# Altium project niryoStepperController.PrjPcb
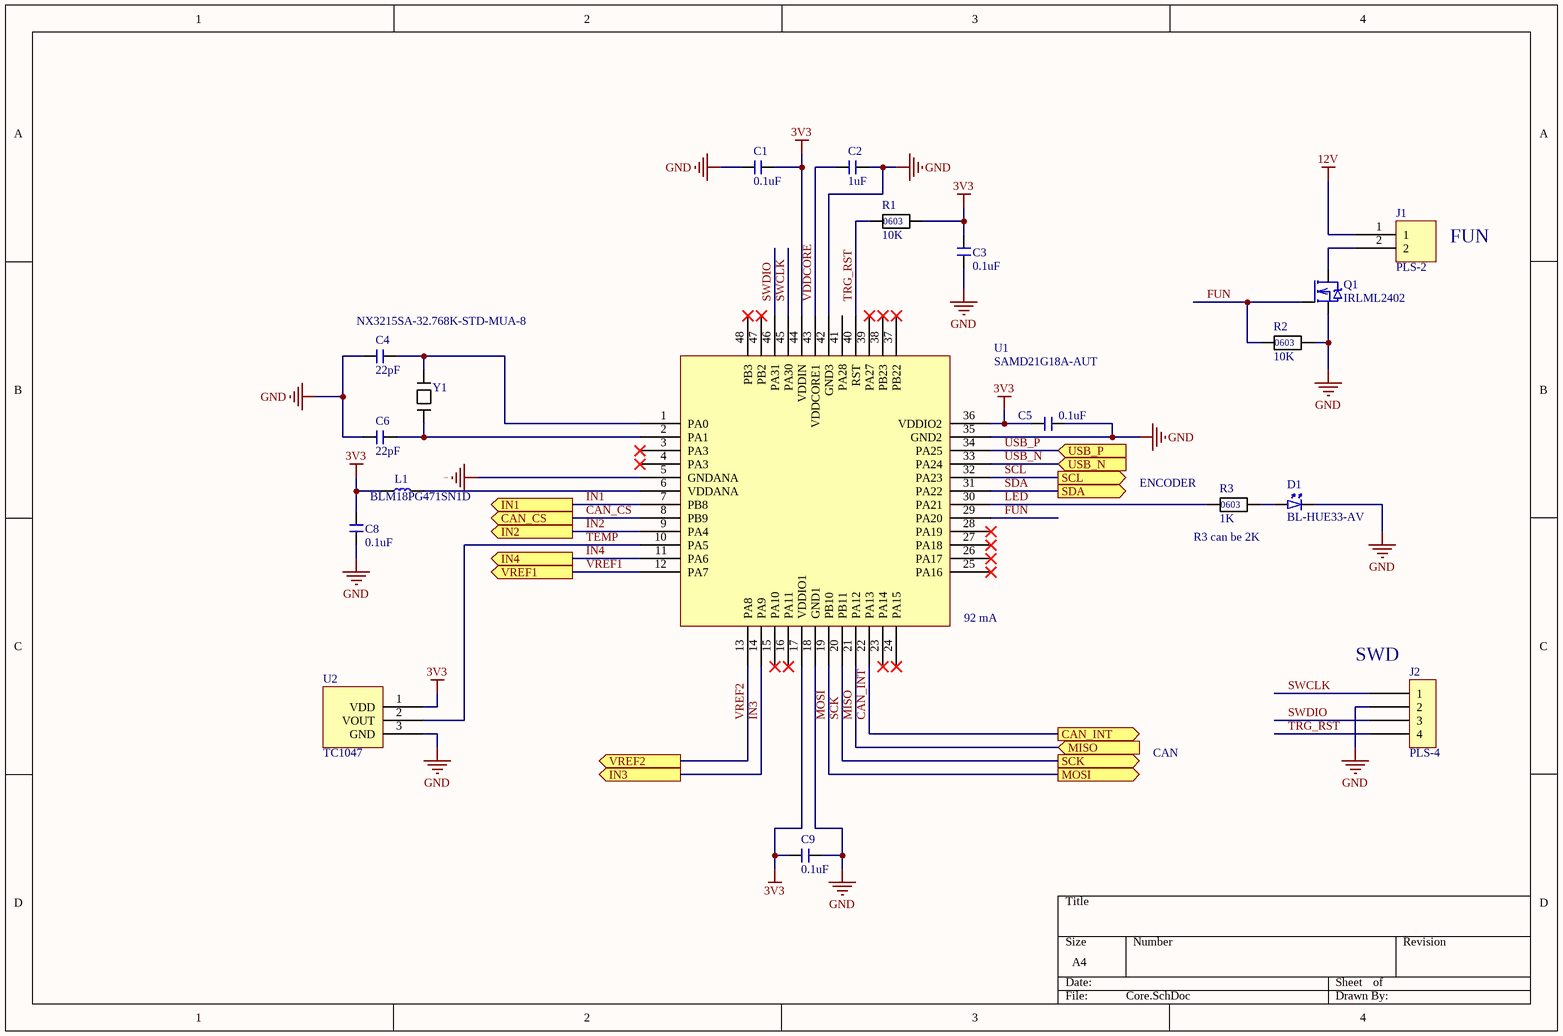
[diagram p0: Core.SchDoc]
3 sheets, 72 parts. Net scope: flat (ports and power ports of the same name join across sheets).
Board file: stepperPCB.PcbDoc
Sheets:
  Core.SchDoc
  Stepper.SchDoc
  CAN.SchDoc

## Sheet Core.SchDoc
size A4

### Parts
C1  0.1uF  [CHIP_C_0603]
C2  1uF  [CHIP_C_0603]
C3  0.1uF  [CHIP_C_0603]
C4  22pF  [CHIP_C_0603]
C5  0.1uF  [CHIP_C_0603]
C6  22pF  [CHIP_C_0603]
C8  0.1uF  [CHIP_C_0603]
C9  0.1uF  [CHIP_C_0603]
D1  BL-HUE33-AV  [CHIP_D_0603]
J1  PLS-2  [PLS-2]
J2  PLS-4  [PLS-4]
L1  BLM18PG471SN1D  [CHIP_R_0603]
Q1  IRLML2402  [SOT23]
R1  10K  [CHIP_R_0603]
R2  10K  [CHIP_R_0603]
R3  1K  [CHIP_R_0603]
U1  SAMD21G18A-AUT  [LQFP48]
U2  TC1047  [SOT23]
Y1  NX3215SA-32.768K-STD-MUA-8  [NX3215SA]

### Ports
CAN_CS (out), CAN_INT (out), IN1 (out), IN2 (out), IN3 (out), IN4 (out), MISO (in), MOSI (out), SCK (out), SCL (out), SDA (out), USB_N (in), USB_P (in), VREF1 (out), VREF2 (out)

### Nets
3V3: C1.2 C3.2 C5.1 C8.2 C9.1 L1.1 R1.2 U1.17(VDDIO1) U1.36(VDDIO2) U1.44(VDDIN) U2.1(VDD)
12V: J1.1
GND: C1.1 C2.2 C3.1 C4.1 C5.2 C6.1 C8.1 C9.2 D1.2(C) J2.2 Q1.2(S) R2.2 U1.5(GNDANA) U1.18(GND1) U1.35(GND2) U1.42(GND3) U2.3(GND)
CAN_CS: U1.8(PB9) ; port CAN_CS
CAN_INT: U1.22(PA13) ; port CAN_INT
FUN: Q1.1(G) R2.1 U1.29(PA20)
IN1: U1.7(PB8) ; port IN1
IN2: U1.9(PA4) ; port IN2
IN3: U1.14(PA9) ; port IN3
IN4: U1.11(PA6) ; port IN4
LED: R3.1 U1.30(PA21)
MISO: U1.21(PA12) ; port MISO
MOSI: U1.19(PB10) ; port MOSI
SCK: U1.20(PB11) ; port SCK
SCL: U1.32(PA23) ; port SCL
SDA: U1.31(PA22) ; port SDA
SWCLK: J2.1 U1.45(PA30)
SWDIO: J2.3 U1.46(PA31)
TEMP: U1.10(PA5) U2.2(VOUT)
TRG_RST: J2.4 R1.1 U1.40(RST)
USB_N: U1.33(PA24) ; port USB_N
USB_P: U1.34(PA25) ; port USB_P
VDDCORE: C2.1 U1.43(VDDCORE1)
VREF1: U1.12(PA7) ; port VREF1
VREF2: U1.13(PA8) ; port VREF2
NetC4_2: C4.2 U1.1(PA0) Y1.2
NetC6_2: C6.2 U1.2(PA1) Y1.1
NetD1_1: D1.1(A) R3.2
NetJ1_2: J1.2 Q1.3(D)
NetL1_2: L1.2 U1.6(VDDANA)

Not connected (* = marked no-connect by the designer): U1 3(PA3)* 4(PA3)* 15(PA10)* 16(PA11)* 23(PA14)* 24(PA15)* 25(PA16)* 26(PA17)* 27(PA18)* 28(PA19)* 37(PB22)* 38(PB23)* 39(PA27)* 41(PA28) 47(PB2)* 48(PB3)*

### Notes on the sheet
- FUN
- (near R3) ENCODER
- R3 can be 2K
- (near U1) 92 mA
- (near J2) SWD
- CAN
- (in symbol RES_0603) 0603

### Library data of the parts
C1-C6 C8 C9 = CHIP_C
D1 = KP-3216: LED
J1 = PLS-2: Connector
L1 = BLM
Q1 = IRLML2402: n-chanal MOSFET
R1-R3 = RES_0603
U2 = TC1047: Temperature Sensor
Y1 = Quartz

## Sheet Stepper.SchDoc
size A4
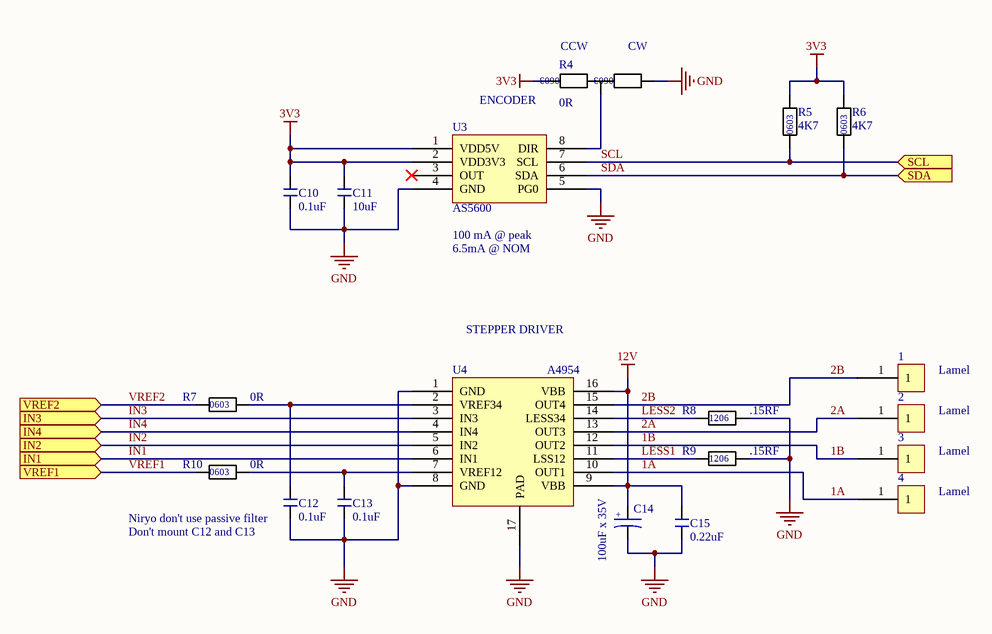
[diagram p1: Stepper.SchDoc]

### Parts
1  Lamel  [LAMEL]
2  Lamel  [LAMEL]
3  Lamel  [LAMEL]
4  Lamel  [LAMEL]
C10  0.1uF  [CHIP_C_0603]
C11  10uF  [CHIP_C_0603]
C12  0.1uF  [CHIP_C_0603]
C13  0.1uF  [CHIP_C_0603]
C14  100uF x 35V  [ALUM_CAP_D]
C15  0.22uF  [CHIP_C_0603]
R4  0R  [0R 0603 selector]
R5  4K7  [CHIP_R_0603]
R6  4K7  [CHIP_R_0603]
R7  0R  [CHIP_R_0603]
R8  .15RF  [CHIP_R_1206]
R9  .15RF  [CHIP_R_1206]
R10  0R  [CHIP_R_0603]
U3  AS5600  [SOIC8]
U4  A4954  [TSSOP-16P]

### Ports
IN1 (in), IN2 (in), IN3 (in), IN4 (in), SCL (in), SDA (in), VREF1 (in), VREF2 (in)

### Nets
3V3: C10.2 C11.2 R4.1 R5.2 R6.2 U3.1(VDD5V) U3.2(VDD3V3)
12V: C14.2 C15.2 U4.9(VBB) U4.16(VBB)
GND: C10.1 C11.1 C12.1 C13.1 C14.1 C15.1 R4.3 R8.2 R9.2 U3.4(GND) U3.5(PG0) U4.1(GND) U4.8(GND) U4.17(PAD)
1A: 4.1 U4.10(OUT1)
1B: 3.1 U4.12(OUT2)
2A: 2.1 U4.13(OUT3)
2B: 1.1 U4.15(OUT4)
IN1: U4.6(IN1) ; port IN1
IN2: U4.5(IN2) ; port IN2
IN3: U4.3(IN3) ; port IN3
IN4: U4.4(IN4) ; port IN4
LESS1: R9.1 U4.11(LSS12)
LESS2: R8.1 U4.14(LESS34)
SCL: R5.1 U3.7(SCL) ; port SCL
SDA: R6.1 U3.6(SDA) ; port SDA
VREF1: R10.1 ; port VREF1
VREF2: R7.1 ; port VREF2
NetC12_2: C12.2 R7.2 U4.2(VREF34)
NetC13_2: C13.2 R10.2 U4.7(VREF12)
NetR4_2: R4.2 U3.8(DIR)

Not connected (* = marked no-connect by the designer): U3 3(OUT)*

### Notes on the sheet
- (near R4) CCW
- (near R4) CW
- ENCODER
- (near U3) 100 mA @ peak
- 6.5mA @ NOM
- STEPPER DRIVER
- (near C12) Niryo don't use passive filter
- (near C12) Don't mount C12 and C13
- (in symbol Electrolit) +
- (in symbol RES_0603) 0603
- (in symbol RES_1206) 1206
- (in symbol Selector_0603) 0603

### Library data of the parts
C10-C13 C15 = CHIP_C
C14 = Electrolit
R4 = Selector_0603
R5-R7 R10 = RES_0603
R8 R9 = RES_1206: Resistor
U3 = AS5600: program magnetic rotary position  sensor
U4 = A4954: DMOS PWM Motor Driver

## Sheet CAN.SchDoc
size A4
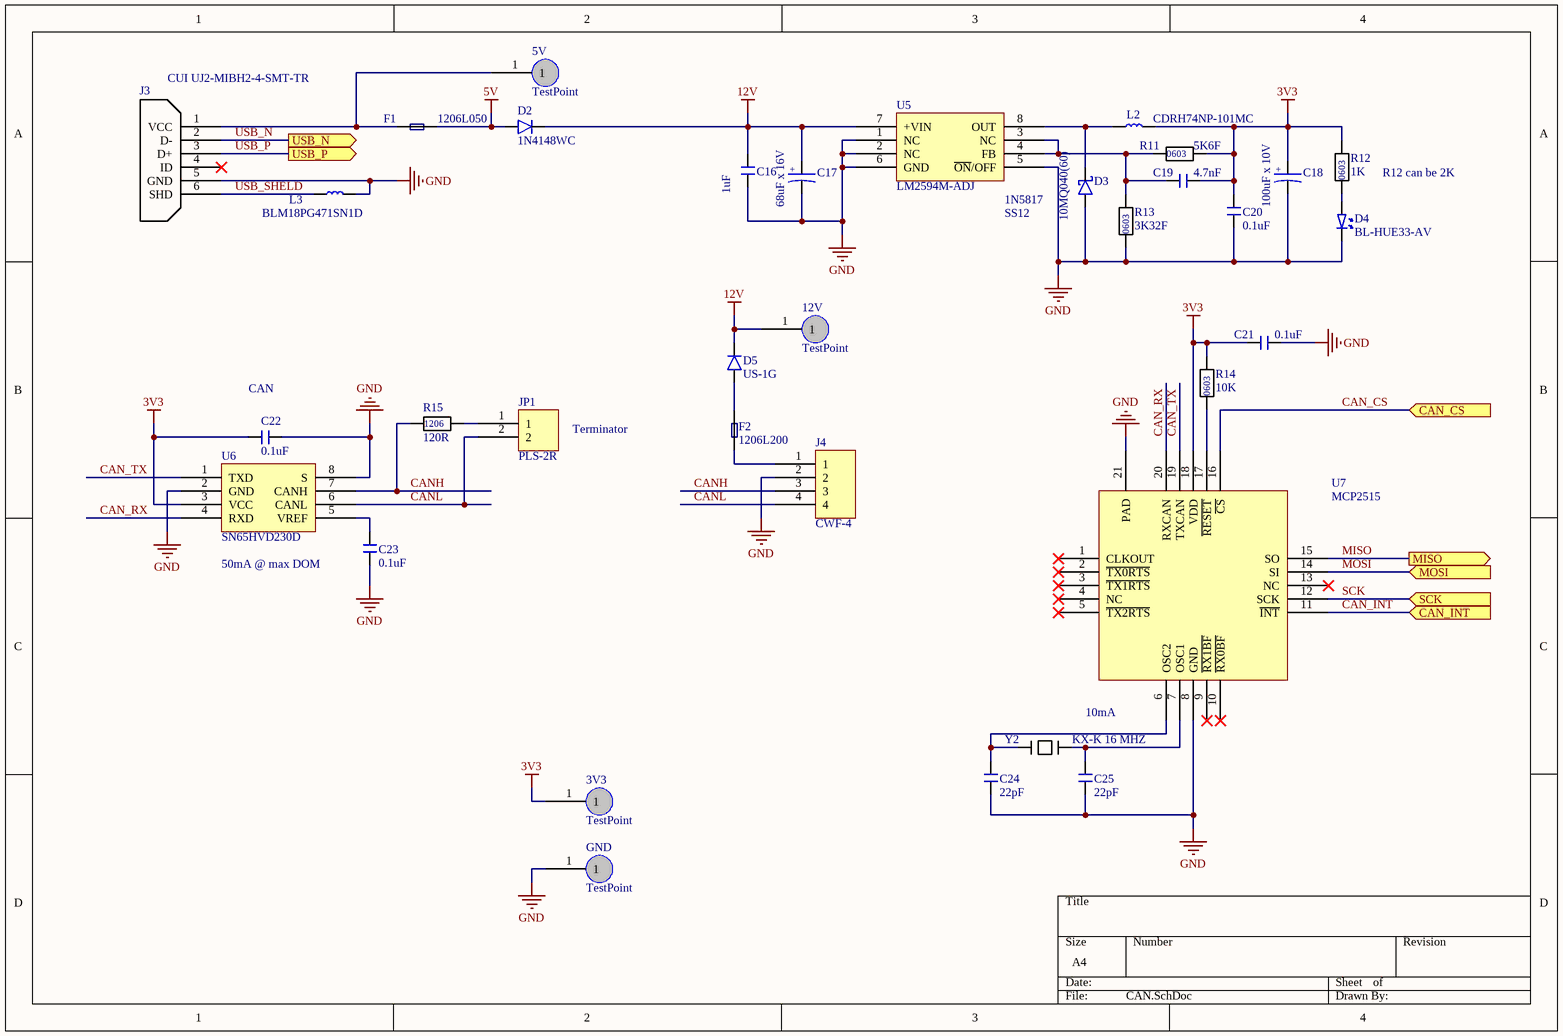
[diagram p2: CAN.SchDoc]

### Parts
3V3  TestPoint  [TestPoint]
5V  TestPoint  [TestPoint]
12V  TestPoint  [TestPoint]
C16  1uF  [CHIP_C_0805]
C17  68uF x 16V  [TANTAL - C]
C18  100uF x 10V  [Tantal - B]
C19  4.7nF  [CHIP_C_0603]
C20  0.1uF  [CHIP_C_0603]
C21  0.1uF  [CHIP_C_0603]
C22  0.1uF  [CHIP_C_0603]
C23  0.1uF  [CHIP_C_0603]
C24  22pF  [CHIP_C_0603]
C25  22pF  [CHIP_C_0603]
D2  1N4148WC  [SOD323]
D3  10MQ040(60)  [DO214-AC]
D4  BL-HUE33-AV  [CHIP_D_0603]
D5  US-1G  [DO214-AC]
F1  1206L050  [1206Lxxx]
F2  1206L200  [1206Lxxx]
GND  TestPoint  [TestPoint]
J3  CUI UJ2-MIBH2-4-SMT-TR  [MicroUSB-mc-258]
J4  CWF-4  [CWF-4R]
JP1  PLS-2R  [PLS-2R]
L2  CDRH74NP-101MC  [CDRH74]
L3  BLM18PG471SN1D  [CHIP_R_0603]
R11  5K6F  [CHIP_R_0603]
R12  1K  [CHIP_R_0603]
R13  3K32F  [CHIP_R_0603]
R14  10K  [CHIP_R_0603]
R15  120R  [CHIP_R_1206]
U5  LM2594M-ADJ  [SOIC8]
U6  SN65HVD230D  [SOIC8]
U7  MCP2515  [QFN20]
Y2  KX-K 16 MHZ  [CHIP_CRYSTAL_5032]

### Ports
CAN_CS (in), CAN_INT (in), MISO (out), MOSI (in), SCK (in), USB_N (out), USB_P (out)

### Nets
3V3: 3V3.1 C18.1 C19.1 C20.2 C21.2 C22.2 L2.2 R11.2 R12.2 R14.2 U6.3(VCC) U7.18(VDD)
5V: D2.2 F1.2
12V: 12V.1 C16.2 C17.1 D2.1 D5.2 U5.7(+VIN)
GND: C16.1 C17.2 C18.2 C20.1 C21.1 C22.1 C23.1 C24.1 C25.1 D3.1 D4.2(C) GND.1 J3.5(GND) J4.2 L3.2 R13.1 U5.1(NC) U5.2(NC) U5.5(~{ON}/OFF) U5.6(GND) U6.2(GND) U6.8(S) U7.8(GND) U7.21(PAD)
CAN_CS: U7.16(~{CS}) ; port CAN_CS
CAN_INT: U7.11(~{INT}) ; port CAN_INT
CAN_RX: U6.4(RXD) U7.20(RXCAN)
CAN_TX: U6.1(TXD) U7.19(TXCAN)
CANH: J4.3 R15.1 U6.7(CANH)
CANL: J4.4 JP1.2 U6.6(CANL)
MISO: U7.15(SO) ; port MISO
MOSI: U7.14(SI) ; port MOSI
SCK: U7.12(SCK) ; port SCK
USB_N: J3.2(D-) ; port USB_N
USB_P: J3.3(D+) ; port USB_P
USB_SHELD: J3.6(SHD) L3.1
Net5V_1: 5V.1 F1.1 J3.1(VCC)
NetC19_2: C19.2 R11.1 R13.2 U5.3(NC) U5.4(FB)
NetC23_2: C23.2 U6.5(VREF)
NetC24_2: C24.2 U7.6(OSC2) Y2.1
NetC25_2: C25.2 U7.7(OSC1) Y2.2
NetD3_2: D3.2 L2.1 U5.8(OUT)
NetD4_1: D4.1(A) R12.1
NetD5_1: D5.1 F2.2
NetF2_1: F2.1 J4.1
NetJP1_1: JP1.1 R15.2
NetR14_1: R14.1 U7.17(~{RESET})

Not connected (* = marked no-connect by the designer): J3 4(ID)*; U7 1(CLKOUT)* 2(~{TX0RTS})* 3(~{TX1RTS})* 4(NC)* 5(~{TX2RTS})* 9(~{RX1BF})* 10(~{RX0BF})* 13(NC)*

### Notes on the sheet
- R12 can be 2K
- 1N5817
- SS12
- (near C22) CAN
- Terminator
- 50mA @ max DOM
- 10mA
- (in symbol RES_0603) 0603
- (in symbol RES_1206) 1206
- (in symbol Tantal) +

### Library data of the parts
C16 C19-C25 = CHIP_C
C17 C18 = Tantal
D3 = 10MQ040: Rectifier diode
D4 = KP-3216: LED
F1 = miniSMDC014F-2: Fuse
F2 = miniSMDC014F-2
J3 = USB_micro: Micro USB connector
JP1 = PLS-2
L2 = CDRH74: Ferrite drum core construction
L3 = BLM
R11-R14 = RES_0603
R15 = RES_1206
U5 = LM2594
U6 = TJA1050
U7 = MCP2515_QFN
Y2 = Quartz

## Nets that join several sheets
3V3: Core (11 pins), Stepper (7 pins), CAN (12 pins)
12V: Core (J1.1), Stepper (C14.2 C15.2 U4.9 U4.16), CAN (6 pins)
GND: Core (17 pins), Stepper (14 pins), CAN (24 pins)
CAN_CS: Core (U1.8), CAN (U7.16)
CAN_INT: Core (U1.22), CAN (U7.11)
IN1: Core (U1.7), Stepper (U4.6)
IN2: Core (U1.9), Stepper (U4.5)
IN3: Core (U1.14), Stepper (U4.3)
IN4: Core (U1.11), Stepper (U4.4)
MISO: Core (U1.21), CAN (U7.15)
MOSI: Core (U1.19), CAN (U7.14)
SCK: Core (U1.20), CAN (U7.12)
SCL: Core (U1.32), Stepper (R5.1 U3.7)
SDA: Core (U1.31), Stepper (R6.1 U3.6)
USB_N: Core (U1.33), CAN (J3.2)
USB_P: Core (U1.34), CAN (J3.3)
VREF1: Core (U1.12), Stepper (R10.1)
VREF2: Core (U1.13), Stepper (R7.1)